# EAGLE design OptimuxPrimeEnlarged (EAGLE 8.4.3)
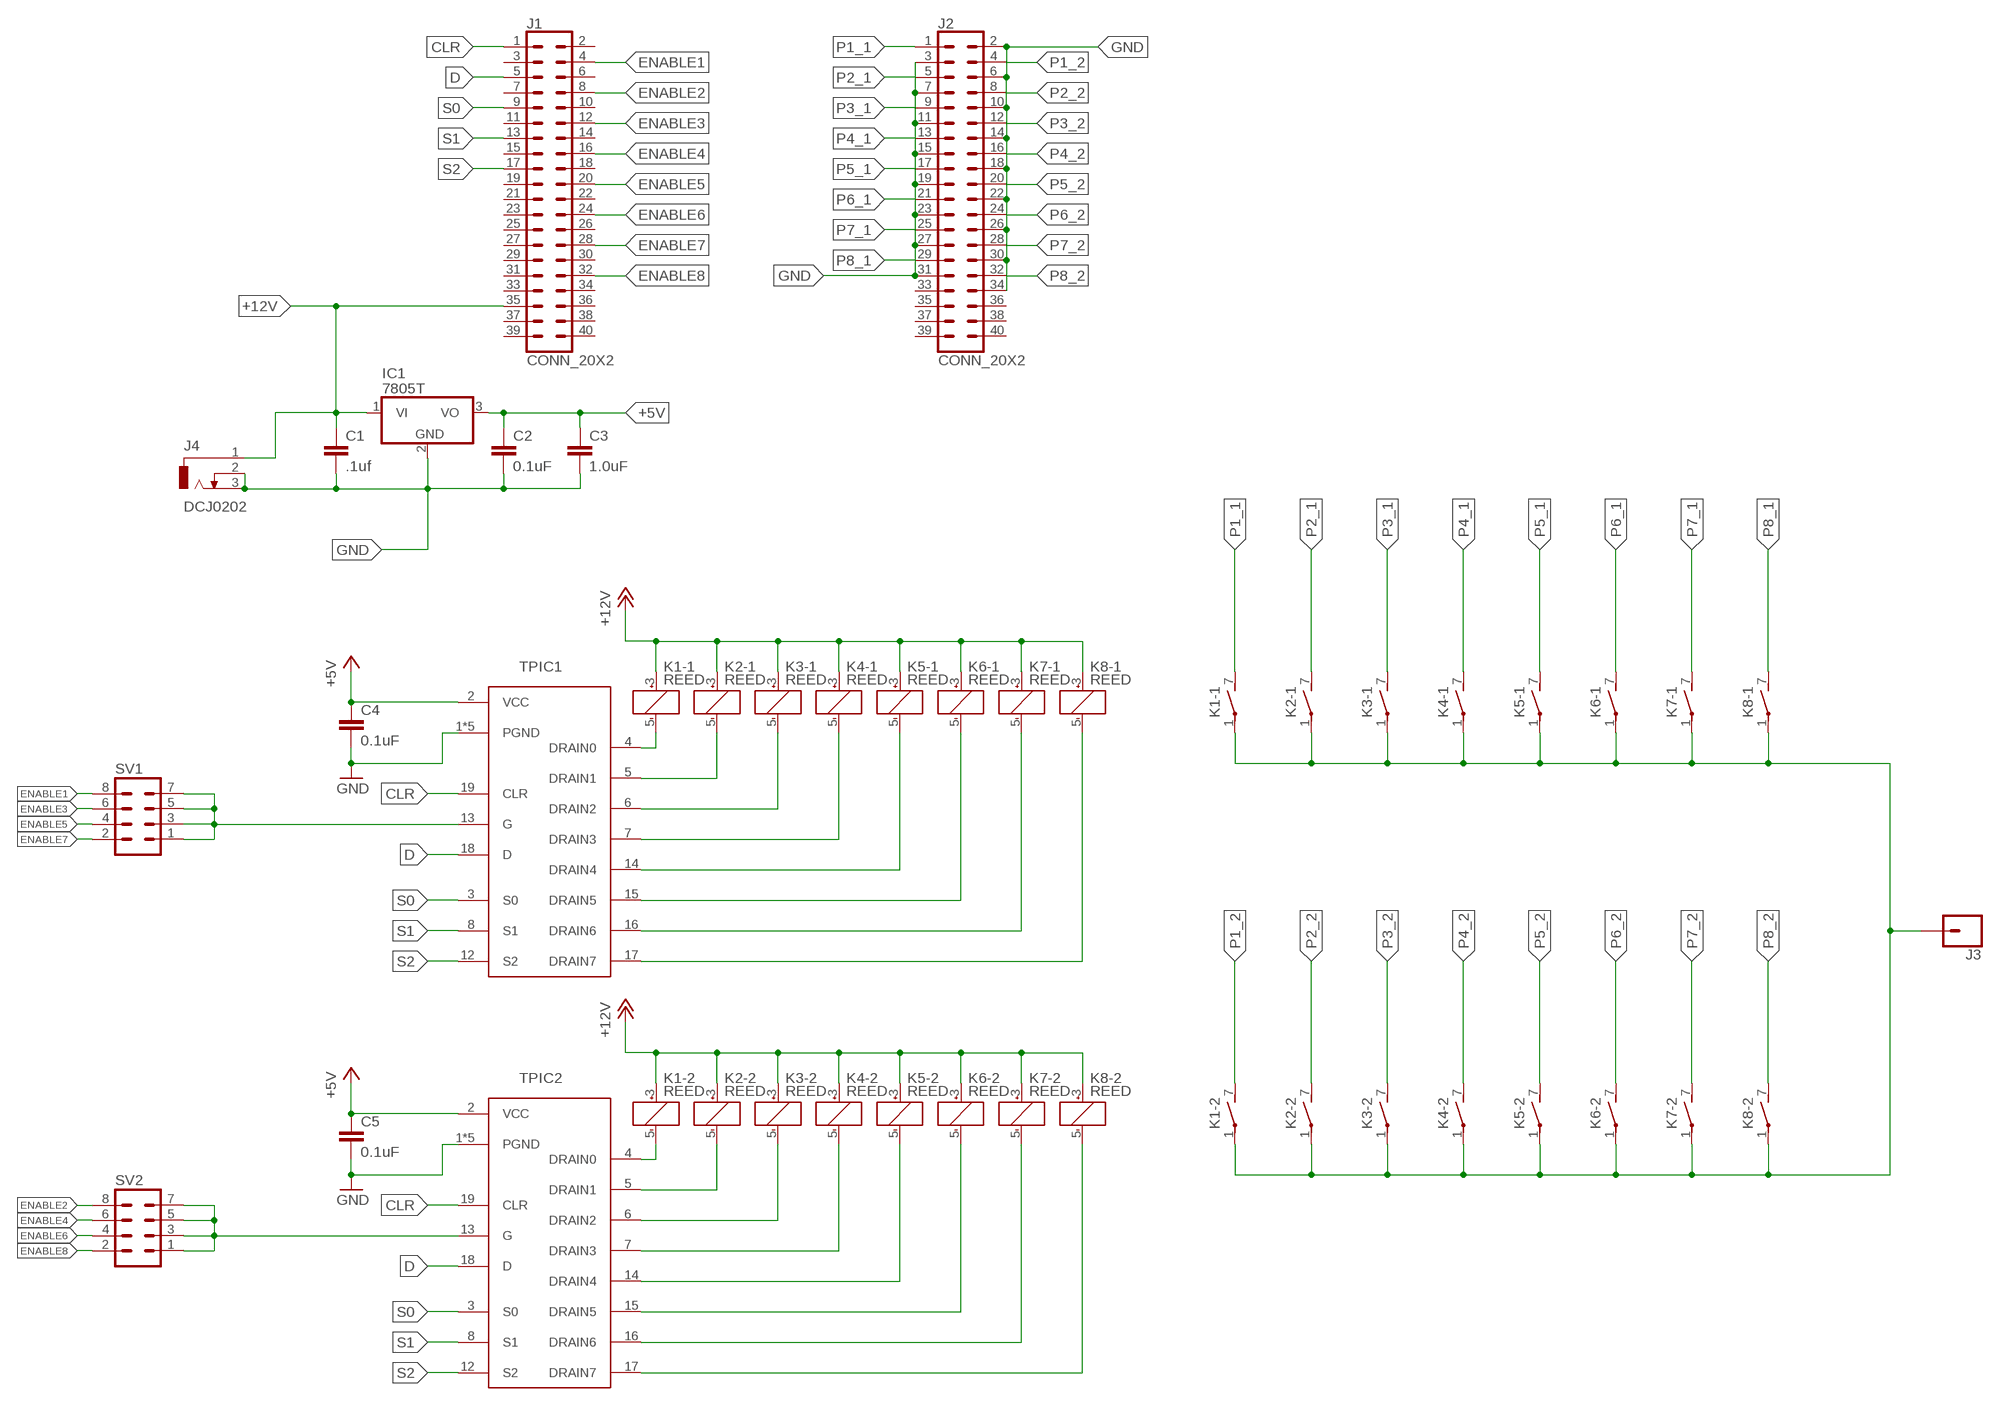
[diagram p0: schematic, sheet 1]

## Parts
C1  .1uf  1.0UF-0805-25V-(+80/-20%)  [0805]
C2  0.1uF  1.0UF-0805-25V-(+80/-20%)  [0805]
C3  1.0uF  1.0UF-0805-25V-(+80/-20%)  [0805]
C4  0.1uF  1.0UF-0805-25V-(+80/-20%)  [0805]
C5  0.1uF  1.0UF-0805-25V-(+80/-20%)  [0805]
IC1  7805T  [TO220H]
J1  CONN_20X2  [2X20]
J2  CONN_20X2  [2X20]
J3  CONN_01  [1X01]
J4  DCJ0202  [DCJ0202]
K1-1  REED  [REED]
K1-2  REED  [REED]
K2-1  REED  [REED]
K2-2  REED  [REED]
K3-1  REED  [REED]
K3-2  REED  [REED]
K4-1  REED  [REED]
K4-2  REED  [REED]
K5-1  REED  [REED]
K5-2  REED  [REED]
K6-1  REED  [REED]
K6-2  REED  [REED]
K7-1  REED  [REED]
K7-2  REED  [REED]
K8-1  REED  [REED]
K8-2  REED  [REED]
SV1  MA04-2  [MA04-2]
SV2  MA04-2  [MA04-2]
TPIC1  TPIC6259  [DIL20]
TPIC2  TPIC6259  [DIL20]

## Nets
+5V: C2.1 C3.1 C4.1 C5.1 IC1.3(VO) TPIC1.2(VCC) TPIC2.2(VCC)
+12V: C1.1 IC1.1(VI) J1.35 J4.1 K1-1.3(1:+) K1-2.3(1:+) K2-1.3(1:+) K2-2.3(1:+) K3-1.3(1:+) K3-2.3(1:+) K4-1.3(1:+) K4-2.3(1:+) K5-1.3(1:+) K5-2.3(1:+) K6-1.3(1:+) K6-2.3(1:+) K7-1.3(1:+) K7-2.3(1:+) K8-1.3(1:+) K8-2.3(1:+)
CLR: J1.1 TPIC1.19(CLR) TPIC2.19(CLR)
D: J1.5 TPIC1.18(D) TPIC2.18(D)
ENABLE1: J1.4 SV1.8
ENABLE2: J1.8 SV2.8
ENABLE3: J1.12 SV1.6
ENABLE4: J1.16 SV2.6
ENABLE5: J1.20 SV1.4
ENABLE6: J1.24 SV2.4
ENABLE7: J1.28 SV1.2
ENABLE8: J1.32 SV2.2
GND: C1.2 C2.2 C3.2 C4.2 C5.2 IC1.2(GND) J2.2 J2.3 J2.6 J2.7 J2.10 J2.11 J2.14 J2.15 J2.18 J2.19 J2.22 J2.23 J2.26 J2.27 J2.30 J2.31 J2.34 J4.2 J4.3 TPIC1.1(PGND) TPIC1.9(PGND) TPIC1.10(PGND) TPIC1.11(PGND) TPIC1.20(PGND) TPIC2.1(PGND) TPIC2.9(PGND) TPIC2.10(PGND) TPIC2.11(PGND) TPIC2.20(PGND)
N$1: K1-1.5(1:-) TPIC1.4(DRAIN0)
N$2: K2-1.5(1:-) TPIC1.5(DRAIN1)
N$3: K3-1.5(1:-) TPIC1.6(DRAIN2)
N$4: K4-1.5(1:-) TPIC1.7(DRAIN3)
N$5: K5-1.5(1:-) TPIC1.14(DRAIN4)
N$6: K6-1.5(1:-) TPIC1.15(DRAIN5)
N$7: K7-1.5(1:-) TPIC1.16(DRAIN6)
N$8: K8-1.5(1:-) TPIC1.17(DRAIN7)
N$9: SV1.1 SV1.3 SV1.5 SV1.7 TPIC1.13(G)
N$17: SV2.1 SV2.3 SV2.5 SV2.7 TPIC2.13(G)
N$18: K1-2.5(1:-) TPIC2.4(DRAIN0)
N$19: K2-2.5(1:-) TPIC2.5(DRAIN1)
N$20: K3-2.5(1:-) TPIC2.6(DRAIN2)
N$21: K4-2.5(1:-) TPIC2.7(DRAIN3)
N$22: K5-2.5(1:-) TPIC2.14(DRAIN4)
N$23: K6-2.5(1:-) TPIC2.15(DRAIN5)
N$24: K7-2.5(1:-) TPIC2.16(DRAIN6)
N$25: K8-2.5(1:-) TPIC2.17(DRAIN7)
P1_1: J2.1 K1-1.7(2:S)
P1_2: J2.4 K1-2.7(2:S)
P2_1: J2.5 K2-1.7(2:S)
P2_2: J2.8 K2-2.7(2:S)
P3_1: J2.9 K3-1.7(2:S)
P3_2: J2.12 K3-2.7(2:S)
P4_1: J2.13 K4-1.7(2:S)
P4_2: J2.16 K4-2.7(2:S)
P5_1: J2.17 K5-1.7(2:S)
P5_2: J2.20 K5-2.7(2:S)
P6_1: J2.21 K6-1.7(2:S)
P6_2: J2.24 K6-2.7(2:S)
P7_1: J2.25 K7-1.7(2:S)
P7_2: J2.28 K7-2.7(2:S)
P8_1: J2.29 K8-1.7(2:S)
P8_2: J2.32 K8-2.7(2:S)
S0: J1.9 TPIC1.3(S0) TPIC2.3(S0)
S1: J1.13 TPIC1.8(S1) TPIC2.8(S1)
S2: J1.17 TPIC1.12(S2) TPIC2.12(S2)
SCOPE_OUT: J3.1 K1-1.1(2:P) K1-2.1(2:P) K2-1.1(2:P) K2-2.1(2:P) K3-1.1(2:P) K3-2.1(2:P) K4-1.1(2:P) K4-2.1(2:P) K5-1.1(2:P) K5-2.1(2:P) K6-1.1(2:P) K6-2.1(2:P) K7-1.1(2:P) K7-2.1(2:P) K8-1.1(2:P) K8-2.1(2:P)
Unconnected: J1.2 J1.3 J1.6 J1.7 J1.10 J1.11 J1.14 J1.15 J1.18 J1.19 J1.21 J1.22 J1.23 J1.25 J1.26 J1.27 J1.29 J1.30 J1.31 J1.33 J1.34 J1.36 J1.37 J1.38 J1.39 J1.40 J2.33 J2.35 J2.36 J2.37 J2.38 J2.39 J2.40

## Library data of the parts
C1 C2 C4 C5 = SparkFun-Capacitors:1.0UF: 1µF ceramic capacitors A capacitor is a passive two-terminal electrical component used to store electrical energy temporarily in an electric field.; PROD_ID: CAP-11625; VALUE: 1.0uF
C3 = SparkFun-Capacitors:1.0UF: 1µF ceramic capacitors A capacitor is a passive two-terminal electrical component used to store electrical energy temporarily in an electric field.; PROD_ID: CAP-11625
IC1 = linear:78*: Positive VOLTAGE REGULATOR Source: http://cache.national.com/ds/LM/LM78L05.pdf http://www.fairchildsemi.com/ds/LM/LM7805.pdf
J1 J2 = SparkFun-Connectors:CONN_20X2: Multi connection point. Often used as Generic Header-pin footprint for 0.1 inch spaced/style header connections On any of the 0.1 inch spaced packages, you can populate with these: Break Away Headers - Straight <https://www.sparkfun.com/products/116> (PRT-00116) Break Away Male Headers - Right Angle <https://www.sparkfun.com/products/553> (PRT-00553) Female Headers <https://www.sparkfun.com/products/115> (PRT-00115) Break Away Headers - Machine Pin <https://www.sparkfun.com/products/117> (PRT-00117) Break Away Female Headers - Swiss Machine Pin <https://www.sparkfun.com/products/743> (PRT-00743)
J3 = SparkFun-Connectors:CONN_01: Single connection point. Often used as Generic Header-pin footprint for 0.1 inch spaced/style header connections On any of the 0.1 inch spaced packages, you can populate with these: Break Away Headers - Straight <https://www.sparkfun.com/products/116> (PRT-00116) Break Away Male Headers - Right Angle <https://www.sparkfun.com/products/553> (PRT-00553) Female Headers <https://www.sparkfun.com/products/115> (PRT-00115) Break Away Headers - Machine Pin <https://www.sparkfun.com/products/117> (PRT-00117) Break Away Female Headers - Swiss Machine Pin <https://www.sparkfun.com/products/743> (PRT-00743) This device is also useful as a general connection point to wire up your design to another part of your project. Our various solder wires solder well into these plated through hole pads. Hook-Up Wire - Assortment (Stranded, 22 AWG) <https://www.sparkfun.com/products/11375> (PRT-11375) Hook-Up Wire - Assortment (Solid Core, 22 AWG) <https://www.sparkfun.com/products/11367> (PRT-11367) View the entire wire category on our website here <https://www.sparkfun.com/categories/141> Special notes: SMTSO-256-ET is a "flush mount" nut for a 4-40 screw. We mostly use this on specialty testbeds; it is a nice way to connect hardware to your PCB at an adjustable hieght. Also note, the SNAP packages are for using a snappable style connector. We sell a baggie of snaps and they are also used on two LilyPad designs: Snap Assortment - 30 pack (male and female) <https://www.sparkfun.com/products/11347> (DEV-11347) LilyPad Arduino SimpleSnap <https://www.sparkfun.com/products/10941> (DEV-10941) LilyPad SimpleSnap Protoboard <https://www.sparkfun.com/products/10940> (DEV-10940)
J4 = con-jack:DCJ0202: DC POWER JACK Source: DCJ0202.pdf; OC_FARNELL: unknown; OC_NEWARK: unknown
K1-1 K1-2 K2-1 K2-2 K3-1 K3-2 K4-1 K4-2 K5-1 K5-2 K6-1 K6-2 K7-1 K7-2 K8-1 K8-2 = relay:REED: RELAY reed, 1 x norm. open with polarity, grid 5.08; OC_FARNELL: unknown; OC_NEWARK: unknown
SV1 SV2 = con-lstb:MA04-2: PIN HEADER; OC_FARNELL: unknown; OC_NEWARK: unknown
TPIC1 TPIC2 = TPIC6259:TPIC6259: Power Logic 8-bit Addressable Latch

## Net classes
0 default: width 0.508 mm

## Board
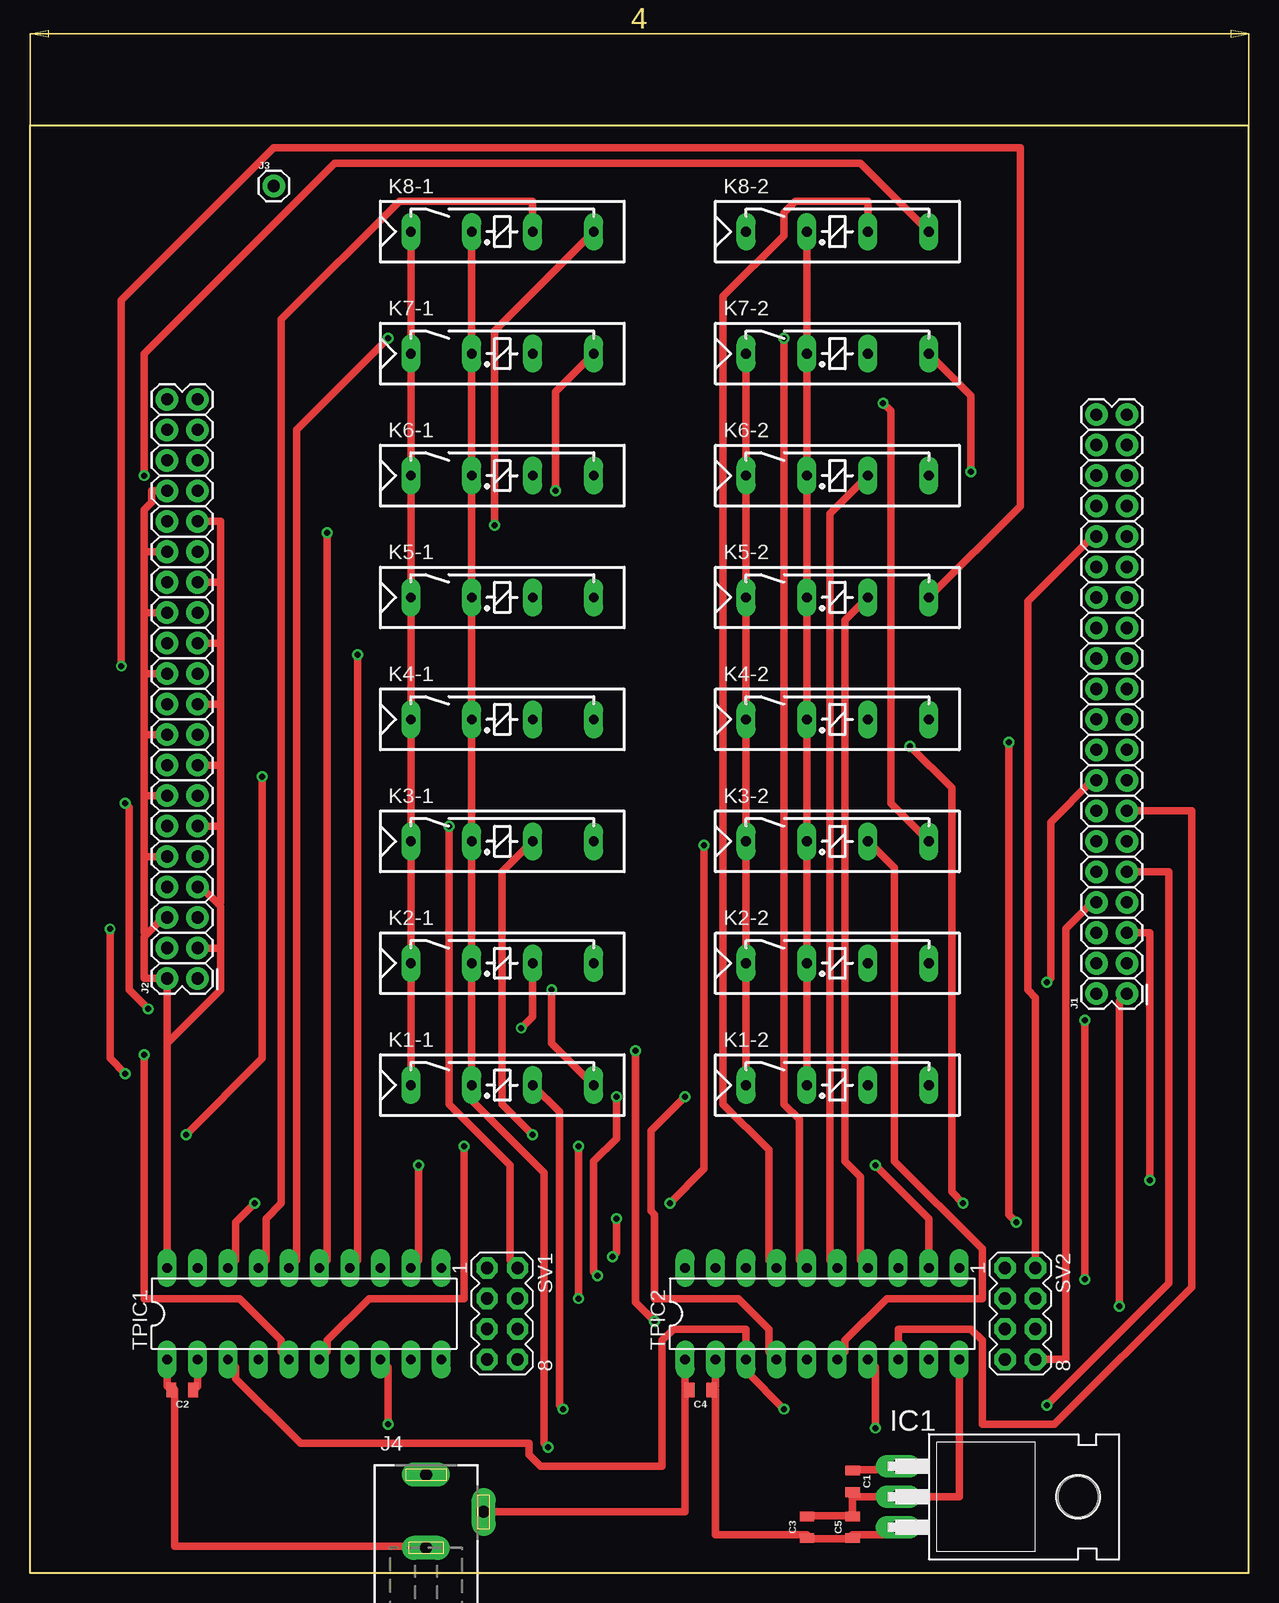
[diagram p1: board, top side]
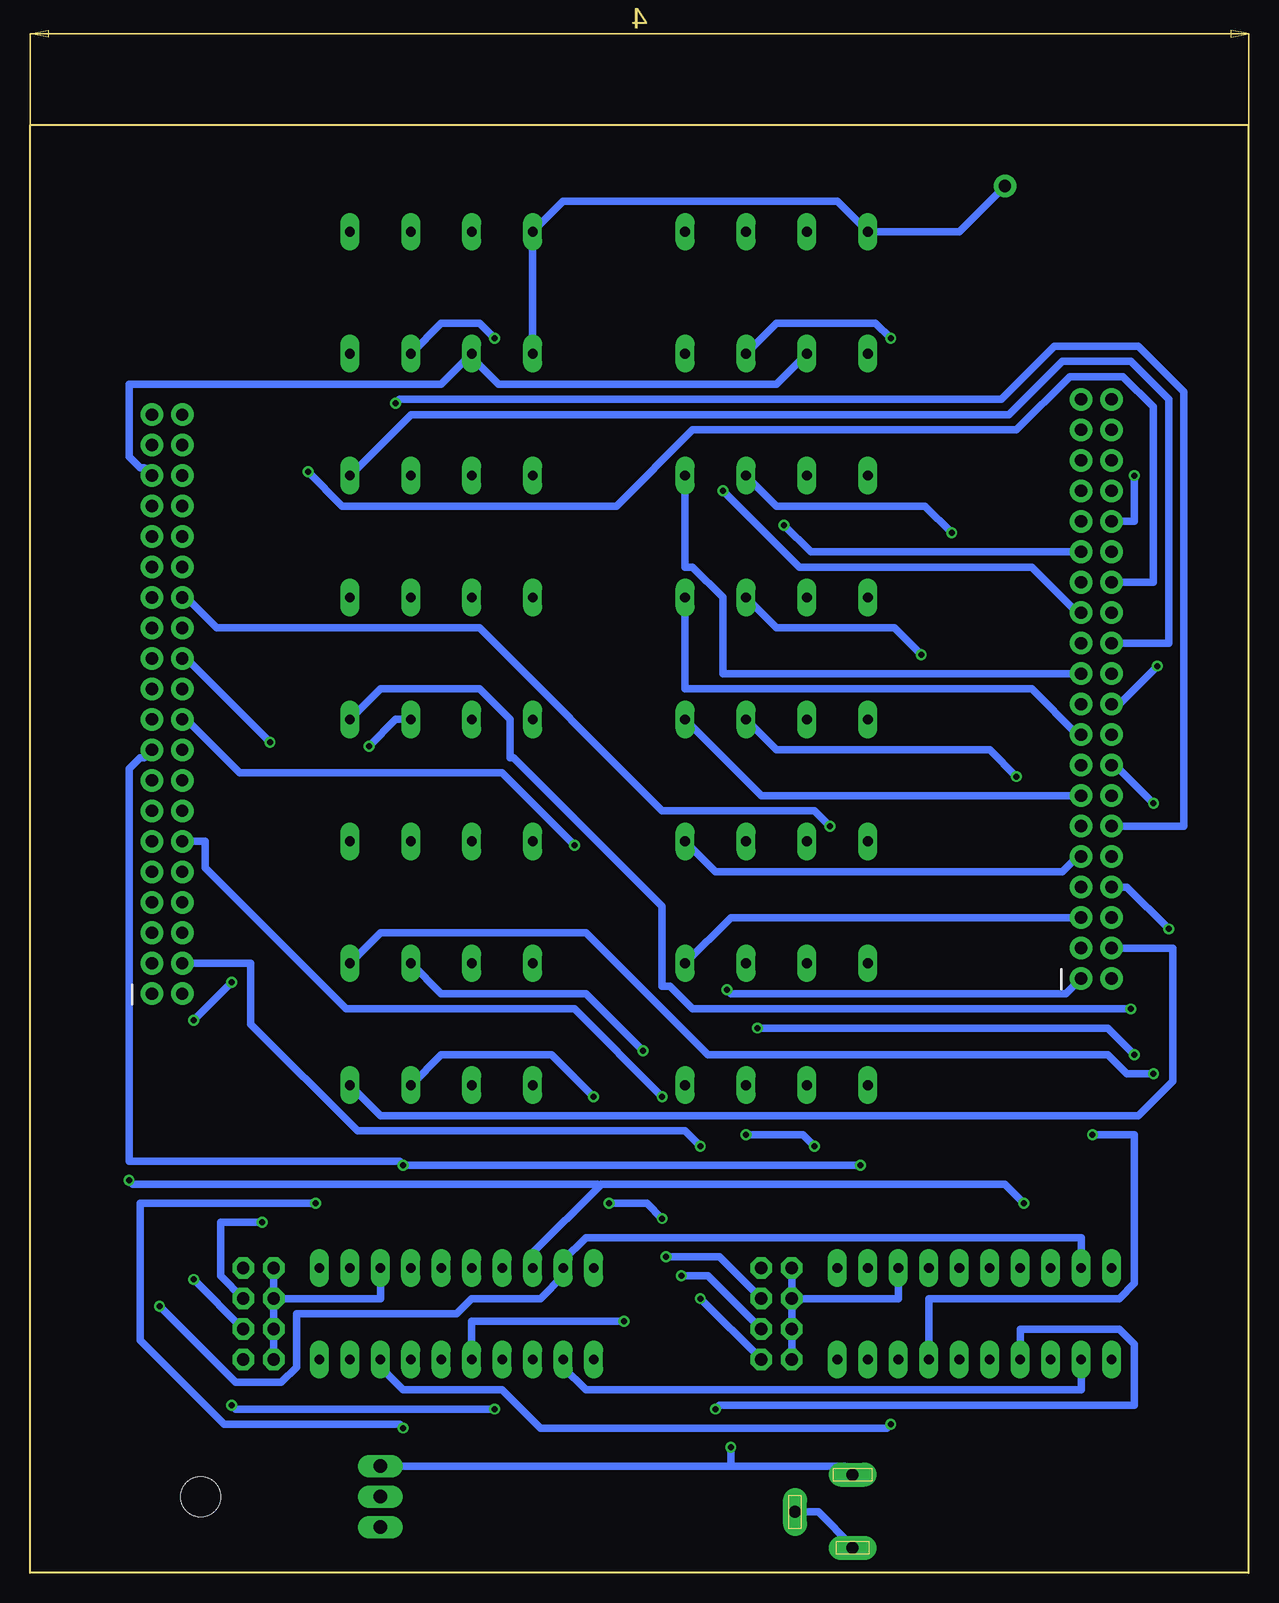
[diagram p2: board, bottom side, seen from below]

Size 101.6 x 120.65 mm. Coordinates in mm from the lower left corner, seen from the top.
Outline: 0,0 0,120.65 101.6,120.65 101.6,0 0,0
Copper layers (1*16): Top 0.035mm / dielectric 1.5mm / Bottom 0.035mm
Design rules "default *": minimum track width 25mil, minimum drill 0.5mm, track to track 25mil, track to pad 25mil, pad to pad 25mil, via to via 25mil, smd to smd 6mil, copper to edge 40mil, drill to drill 6mil, minimum pad ring 15mil, minimum via ring 8mil, stop-mask expansion 4mil, vias tented up to drill 0mil, thermal gap 10mil

### Footprints (pad centres in the part's own frame; a part is rotated, then mirrored left to right if it is on the bottom)
0805 = smd 0.8 x 1.2: 1 -0.9,0; 2 0.9,0
TO220H = drill 1.118 long: 1 -2.54,-10.16; 2 0,-10.16; 3 2.54,-10.16 | hole 3.302: 0,4.826
2X20 = drill 1.016 pad 1.88: 1 0,0; 2 0,2.54; 3 2.54,0; 4 2.54,2.54; 5 5.08,0; 6 5.08,2.54; 7 7.62,0; 8 7.62,2.54; 9 10.16,0; 10 10.16,2.54; 11 12.7,0; 12 12.7,2.54; 13 15.24,0; 14 15.24,2.54; 15 17.78,0; 16 17.78,2.54; 17 20.32,0; 18 20.32,2.54; 19 22.86,0; 20 22.86,2.54; 21 25.4,0; 22 25.4,2.54; 23 27.94,0; 24 27.94,2.54; 25 30.48,0; 26 30.48,2.54; 27 33.02,0; 28 33.02,2.54; 29 35.56,0; 30 35.56,2.54; 31 38.1,0; 32 38.1,2.54; 33 40.64,0; 34 40.64,2.54; 35 43.18,0; 36 43.18,2.54; 37 45.72,0; 38 45.72,2.54; 39 48.26,0; 40 48.26,2.54
1X01 = drill 1.016 pad 1.88: 1 0,0
DCJ0202 = drill 1 pad 2 long: 1 0,3.1; 2 4.8,0; 3 0,-3
REED = drill 0.813 long: 1 -17.78,2.54; 3 -12.7,2.54; 5 -7.62,2.54; 7 -2.54,2.54
MA04-2 = drill 1.016 octagon: 1 -3.81,-1.27; 2 -3.81,1.27; 3 -1.27,-1.27; 4 -1.27,1.27; 5 1.27,-1.27; 6 1.27,1.27; 7 3.81,-1.27; 8 3.81,1.27
DIL20 = drill 0.813 long: 1 -11.43,-3.81; 2 -8.89,-3.81; 3 -6.35,-3.81; 4 -3.81,-3.81; 5 -1.27,-3.81; 6 1.27,-3.81; 7 3.81,-3.81; 8 6.35,-3.81; 9 8.89,-3.81; 10 11.43,-3.81; 11 11.43,3.81; 12 8.89,3.81; 13 6.35,3.81; 14 3.81,3.81; 15 1.27,3.81; 16 -1.27,3.81; 17 -3.81,3.81; 18 -6.35,3.81; 19 -8.89,3.81; 20 -11.43,3.81

### Placement (x,y rotation side)
C1  68.58,7.62 270 top
C2  12.7,15.24 180 top
C3  64.77,3.81 90 top
C4  55.88,15.24 180 top
C5  68.58,3.81 90 top
IC1  82.55,6.35 270 top
J1  91.44,48.26 90 top
J2  13.97,49.53 90 top
J3  20.32,115.57 0 top
J4  33.02,5.08 0 top
K1-1  49.53,38.1 0 top
K1-2  77.47,38.1 0 top
K2-1  49.53,48.26 0 top
K2-2  77.47,48.26 0 top
K3-1  49.53,58.42 0 top
K3-2  77.47,58.42 0 top
K4-1  49.53,68.58 0 top
K4-2  77.47,68.58 0 top
K5-1  49.53,78.74 0 top
K5-2  77.47,78.74 0 top
K6-1  49.53,88.9 0 top
K6-2  77.47,88.9 0 top
K7-1  49.53,99.06 0 top
K7-2  77.47,99.06 0 top
K8-1  49.53,109.22 0 top
K8-2  77.47,109.22 0 top
SV1  39.37,21.59 270 top
SV2  82.55,21.59 270 top
TPIC1  22.86,21.59 0 top
TPIC2  66.04,21.59 0 top

### Tracks (layer width: path | path; a pad name or v marks a point on that pad's centre or on a via)
+5V
  Top 0.635: IC1.3 72.39,3.17 68.58,3.17 C5.1 68.58,2.86 64.77,2.86 C3.1 64.77,3.17 57.15,3.17 57.15,15.24 C4.1 56.83,15.24 57.15,15.56 TPIC2.2 | TPIC1.2 13.97,15.56 13.65,15.24 C2.1
  Bottom 0.635: TPIC1.2 13.97,15.24 55.24,15.24 57.15,17.14 TPIC2.2
+12V  (via drill 0.5)
  Top 0.635: K8-2.3 K7-2.3 K6-2.3 K5-2.3 K4-2.3 K3-2.3 K2-2.3 K1-2.3 | IC1.1 72.39,8.57 68.58,8.57 C1.1 | K8-1.3 K7-1.3 K6-1.3 K5-1.3 K4-1.3 K3-1.3 K2-1.3 K1-1.3 36.83,39.37 42.86,33.34 42.86,10.79 v43.18,10.48
  Bottom 0.635: J1.35 92.08,92.08 92.39,92.08 93.34,93.03 93.34,99.06 67.31,99.06 K7-2.3 64.77,101.28 62.55,99.06 39.37,99.06 K7-1.3 | IC1.1 43.18,8.89 | 43.18,8.89 33.66,8.89 33.02,8.26 J4.1 | v43.18,10.48 43.18,8.89
CLR  (via drill 0.5)
  Top 0.635: J1.1 90.81,47.62 v90.81,22.23
  Bottom 0.635: TPIC1.19 13.97,27.94 55.24,27.94 57.15,26.04 TPIC2.19 57.15,24.77 59.05,22.86 64.77,22.86 66.04,21.59 79.38,21.59 79.38,17.14 80.64,15.88 84.45,15.88 v90.81,22.23
D  (via drill 0.5)
  Top 0.635: TPIC1.18 17.14,26.04 17.14,29.21 v18.73,30.8 | J1.5 93.34,53.34 v93.34,32.7
  Bottom 0.635: v18.73,30.8 20.32,32.38 53.98,32.38 54.13,32.23 | 54.13,32.23 59.69,26.67 TPIC2.18 | v93.34,32.7 93.03,32.38 54.29,32.38 54.13,32.23
ENABLE1  (via drill 0.5)
  Top 0.635: v45.72,35.56 v45.72,22.86
  Bottom 0.635: v45.72,22.86 SV1.8 | v45.72,35.56 46.99,36.83 74.3,36.83 83.19,45.72 83.19,50.8 J1.4
ENABLE2
  Top 0.635: SV2.8 86.36,17.78 86.36,53.66 88.58,55.88 J1.8
ENABLE3  (via drill 0.5)
  Top 0.635: v47.31,24.77 46.99,25.08 46.99,34.29 48.9,36.2 v48.9,39.69
  Bottom 0.635: SV1.6 45.09,24.77 v47.31,24.77 | v48.9,39.69 56.2,46.99 75.25,46.99 87,58.74 87,60.96 J1.12
ENABLE4  (via drill 0.5)
  Top 0.635: v87.95,46.04 v87.95,24.45 | v84.77,49.21 85.09,49.53 85.09,62.55 88.58,66.04 J1.16
  Bottom 0.635: v87.95,24.45 SV2.6 | v84.77,49.21 v87.95,46.04
ENABLE5  (via drill 0.5)
  Top 0.635: v48.58,26.35 48.9,26.67 v48.9,29.53 | v53.34,30.8 56.2,33.66 v56.2,60.64
  Bottom 0.635: SV1.4 44.13,26.35 v48.58,26.35 | v48.9,29.53 50.16,30.8 v53.34,30.8 | v56.2,60.64 62.23,66.67 84.14,66.67 88.58,71.12 J1.20
ENABLE6  (via drill 0.5)
  Top 0.635: v82.23,29.21 81.6,29.84 v81.6,69.22
  Bottom 0.635: SV2.4 85.72,24.77 85.72,29.21 v82.23,29.21 | v81.6,69.22 88.58,76.2 J1.24
ENABLE7  (via drill 0.5)
  Top 0.635: SV1.2 40.01,26.04 40.01,33.97 34.92,39.05 v34.92,62.23
  Bottom 0.635: v34.92,62.23 36.2,63.5 48.9,63.5 64.14,78.74 86.04,78.74 88.58,81.28 J1.28
ENABLE8
  Top 0.635: SV2.2 83.82,47.94 83.19,48.58 83.19,80.96 88.58,86.36 J1.32
GND
  Top 0.635: 68.58,4.76 64.77,4.76 C3.2 | 68.58,4.76 68.58,6.35 | 68.58,6.35 C1.2 68.58,6.67 | 68.58,4.76 C5.2 | 68.58,6.35 IC1.2 77.47,6.35 TPIC2.10 | TPIC2.1 54.61,15.56 54.93,15.24 C4.2 54.61,15.24 54.61,5.08 J4.2 | 15.88,52.07 J2.3 | 15.88,52.07 15.88,55.56 15.72,55.72 | 15.72,55.72 14.29,57.15 J2.7 | 15.88,62.23 J2.11 | 15.88,62.23 15.88,55.88 15.72,55.72 | 15.88,67.31 J2.15 | 15.88,62.23 15.88,67.31 | 15.88,72.39 J2.19 | 15.88,67.31 15.88,72.39 | 15.88,77.47 J2.23 | 15.88,72.39 15.88,77.47 | 15.88,82.55 J2.27 | 15.88,77.47 15.88,82.55 | J2.31 15.88,87.63 15.88,82.55 | TPIC1.1 11.43,15.56 11.75,15.24 C2.2 12.06,15.24 12.06,2.22 33.02,2.22 J4.3 | 9.68,53.18 11.11,54.61 J2.6 | 9.68,53.18 9.53,53.02 9.53,49.53 J2.2 11.43,44.13 | 9.53,59.69 J2.10 | 9.53,59.69 9.53,53.34 9.68,53.18 | 9.53,64.77 J2.14 | 9.53,59.69 9.53,64.77 | 9.53,69.85 J2.18 | 9.53,64.77 9.53,69.85 | 9.53,74.93 J2.22 | 9.53,69.85 9.53,74.93 | 9.53,80.01 J2.26 | 9.53,74.93 9.53,80.01 | 9.53,85.09 J2.30 | 9.53,80.01 9.53,85.09 | J2.34 10.16,90.17 10.16,89.22 9.53,88.58 9.53,85.09 | 11.43,44.13 TPIC1.20 | 15.88,52.07 15.88,48.58 11.43,44.13
  Bottom 0.635: J4.2 35.88,5.08 33.02,2.22 J4.3
N$1  (via drill 0.5)
  Top 0.635: v44.45,13.65 44.13,13.97 44.13,38.42 K1-1.5
  Bottom 0.635: TPIC1.4 19.05,20.32 10.79,20.32 9.53,19.05 9.53,13.97 44.13,13.97 v44.45,13.65
N$2  (via drill 0.5)
  Top 0.635: TPIC1.5 20.95,18.41 20.95,19.37 17.46,22.86 9.53,22.86 v9.53,43.18 | v40.96,45.4 41.91,46.35 K2-1.5
  Bottom 0.635: v9.53,43.18 11.75,45.4 v40.96,45.4
N$3  (via drill 0.5)
  Top 0.635: TPIC1.6 24.77,18.41 24.77,19.37 28.26,22.86 36.2,22.86 v36.2,35.56 | v41.91,36.51 39.37,39.05 39.37,58.42 K3-1.5
  Bottom 0.635: v36.2,35.56 37.15,36.51 v41.91,36.51
N$4  (via drill 0.5)
  Top 0.635: v13.02,36.51 19.37,42.86 v19.37,66.36
  Bottom 0.635: TPIC1.7 26.67,22.86 10.79,22.86 9.53,24.13 9.53,36.51 v13.02,36.51 | v19.37,66.36 21.59,68.58 39.37,68.58 K4-1.5
N$5  (via drill 0.5)
  Top 0.635: TPIC1.14 27.3,26.04 v27.3,76.52
  Bottom 0.635: v27.3,76.52 29.53,78.74 39.37,78.74 K5-1.5
N$6  (via drill 0.5)
  Top 0.635: TPIC1.15 24.77,26.04 v24.77,86.68
  Bottom 0.635: v24.77,86.68 26.99,88.9 39.37,88.9 K6-1.5
N$7  (via drill 0.5)
  Top 0.635: TPIC1.16 22.23,26.04 22.23,95.25 v29.84,102.87
  Bottom 0.635: v29.84,102.87 31.11,104.14 39.37,104.14 K7-1.5
N$8
  Top 0.635: TPIC1.17 19.68,26.04 19.68,29.53 20.95,30.8 20.95,104.46 30.8,114.3 41.91,114.3 K8-1.5
N$9
  Bottom 0.635: SV1.7 SV1.5 SV1.3 | TPIC1.13 29.21,22.86 SV1.3 | SV1.3 SV1.1
N$17
  Bottom 0.635: SV2.7 SV2.5 SV2.3 | TPIC2.13 72.39,22.86 SV2.3 | SV2.3 SV2.1
N$18  (via drill 0.5)
  Top 0.635: TPIC2.4 61.59,18.41 61.59,20.32 59.05,22.86 52.07,22.86 52.07,29.84 51.75,30.16 51.75,36.83 v54.61,39.69
  Bottom 0.635: v54.61,39.69 58.1,43.18 67.31,43.18 K1-2.5
N$19  (via drill 0.5)
  Top 0.635: v52.07,20.95 50.48,22.54 v50.48,43.5
  Bottom 0.635: TPIC2.5 64.77,20.95 v52.07,20.95 | v50.48,43.5 55.24,48.26 67.31,48.26 K2-2.5
N$20
  Top 0.635: TPIC2.6 67.94,18.41 67.94,19.37 71.44,22.86 79.38,22.86 79.38,26.99 72.07,34.29 72.07,58.74 K3-2.5
N$21  (via drill 0.5)
  Top 0.635: TPIC2.7 70.48,17.14 v70.48,12.06 | v77.79,30.8 76.83,31.75 76.83,65.41 v73.34,68.9
  Bottom 0.635: v70.48,12.06 70.8,12.38 85.41,12.38 92.39,19.37 92.39,30.8 v77.79,30.8 | v73.34,68.9 71.12,71.12 K4-2.5
N$22
  Top 0.635: TPIC2.14 69.22,26.04 69.22,33.02 67.94,34.29 67.94,79.38 K5-2.5
N$23
  Top 0.635: TPIC2.15 66.67,26.04 66.67,88.27 K6-2.5
N$24  (via drill 0.5)
  Top 0.635: TPIC2.16 64.14,26.04 64.14,37.78 62.87,39.05 v62.87,102.87
  Bottom 0.635: v62.87,102.87 64.14,104.14 67.31,104.14 K7-2.5
N$25
  Top 0.635: TPIC2.17 61.59,26.04 61.59,35.24 57.78,39.05 57.78,106.36 62.87,111.44 62.87,113.35 63.82,114.3 69.85,114.3 K8-2.5
P1_1  (via drill 0.5)
  Top 0.635: K1-1.7 43.5,44.13 v43.5,48.58
  Bottom 0.635: v43.5,48.58 43.18,48.26 15.24,48.26 J2.1
P1_2
  Bottom 0.635: K1-2.7 72.39,38.1 9.21,38.1 6.35,40.96 6.35,52.07 J2.4
P2_1
  Bottom 0.635: K2-1.7 43.18,54.61 J2.5
P2_2  (via drill 0.5)
  Top 0.635: v7.94,41.59 6.67,42.86 v6.67,53.66
  Bottom 0.635: K2-2.7 72.39,53.34 55.24,53.34 45.09,43.18 11.75,43.18 10.16,41.59 v7.94,41.59 | v6.67,53.66 10.16,57.15 J2.8
P3_1
  Bottom 0.635: K3-1.7 44.45,58.42 15.56,58.42 14.29,59.69 J2.9
P3_2  (via drill 0.5)
  Top 0.635: K3-2.7 71.75,64.14 71.75,96.84 v71.12,97.47
  Bottom 0.635: v71.12,97.47 70.8,97.79 20.64,97.79 16.19,102.23 9.21,102.23 5.4,98.42 5.4,62.23 J2.12
P4_1
  Bottom 0.635: K4-1.7 40.64,64.77 J2.13
P4_2  (via drill 0.5)
  Top 0.635: v9.84,46.99 8.26,48.58 8.26,63.82 v7.94,64.14
  Bottom 0.635: K4-2.7 72.39,73.66 64.14,73.66 61.59,71.12 61.59,67.94 61.28,67.94 48.9,55.56 48.9,48.9 48.26,48.9 46.35,46.99 v9.84,46.99 | v7.94,64.14 11.11,67.31 J2.16
P5_1
  Bottom 0.635: K5-1.7 46.99,73.66 18.1,73.66 14.29,69.85 J2.17
P5_2  (via drill 0.5)
  Top 0.635: K5-2.7 82.55,88.9 82.55,118.75 20.32,118.75 7.62,106.05 v7.62,75.56
  Bottom 0.635: v7.62,75.56 10.79,72.39 J2.20
P6_1
  Bottom 0.635: K6-1.7 46.99,83.82 46.35,83.82 43.81,81.28 43.81,74.93 J2.21
P6_2
  Bottom 0.635: K6-2.7 69.85,96.52 20,96.52 15.56,100.97 9.84,100.97 6.67,97.79 6.67,77.47 J2.24
P7_1  (via drill 0.5)
  Top 0.635: K7-1.7 43.81,98.42 v43.81,90.17
  Bottom 0.635: v43.81,90.17 37.47,83.82 18.1,83.82 14.29,80.01 J2.25
P7_2  (via drill 0.5)
  Top 0.635: K7-2.7 78.42,98.11 v78.42,91.76
  Bottom 0.635: v78.42,91.76 75.56,88.9 52.7,88.9 46.35,95.25 19.37,95.25 14.92,99.69 10.48,99.69 7.94,97.16 7.94,82.55 J2.28
P8_1  (via drill 0.5)
  Top 0.635: K8-1.7 38.73,103.5 v38.73,87.31
  Bottom 0.635: v38.73,87.31 36.51,85.09 J2.29
P8_2  (via drill 0.5)
  Top 0.635: K8-2.7 69.22,117.47 25.4,117.47 9.53,101.6 v9.53,91.44
  Bottom 0.635: v9.53,91.44 9.53,87.63 J2.32
S0  (via drill 0.5)
  Top 0.635: TPIC1.3 17.14,17.14 17.14,16.19 22.54,10.79 41.59,10.79 41.59,9.84 42.55,8.89 52.7,8.89 52.7,19.37 53.66,20.32 59.69,20.32 TPIC2.3 59.69,16.83 v62.87,13.65 | J1.9 94.93,58.42 94.93,24.13 v84.77,13.97
  Bottom 0.635: v84.77,13.97 84.45,13.65 v62.87,13.65
S1  (via drill 0.5)
  Top 0.635: TPIC1.8 29.84,17.14 v29.84,12.38 | J1.13 96.84,63.5 96.84,23.81 85.41,12.38 79.38,12.38 79.38,19.37 78.42,20.32 72.39,20.32 TPIC2.8
  Bottom 0.635: v29.84,12.38 30.16,12.06 59.05,12.06 62.23,15.24 70.48,15.24 72.39,17.14 TPIC2.8
S2  (via drill 0.5)
  Top 0.635: TPIC1.12 32.38,26.04 v32.38,33.97 | v70.48,33.97 74.93,29.53 TPIC2.12
  Bottom 0.635: v32.38,33.97 v70.48,33.97 70.8,34.29 93.34,34.29 93.34,66.99 92.39,67.94 92.08,67.94 J1.17
SCOPE_OUT
  Top 0.635: K1-2.1 K2-2.1 K3-2.1 K4-2.1 K5-2.1 K6-2.1 K7-2.1 | K8-1.1 K7-1.1 K6-1.1 K5-1.1 K4-1.1 K3-1.1 K2-1.1 K1-1.1
  Bottom 0.635: K7-2.1 K8-2.1 57.15,114.3 34.29,114.3 K8-1.1 24.13,111.76 J3.1